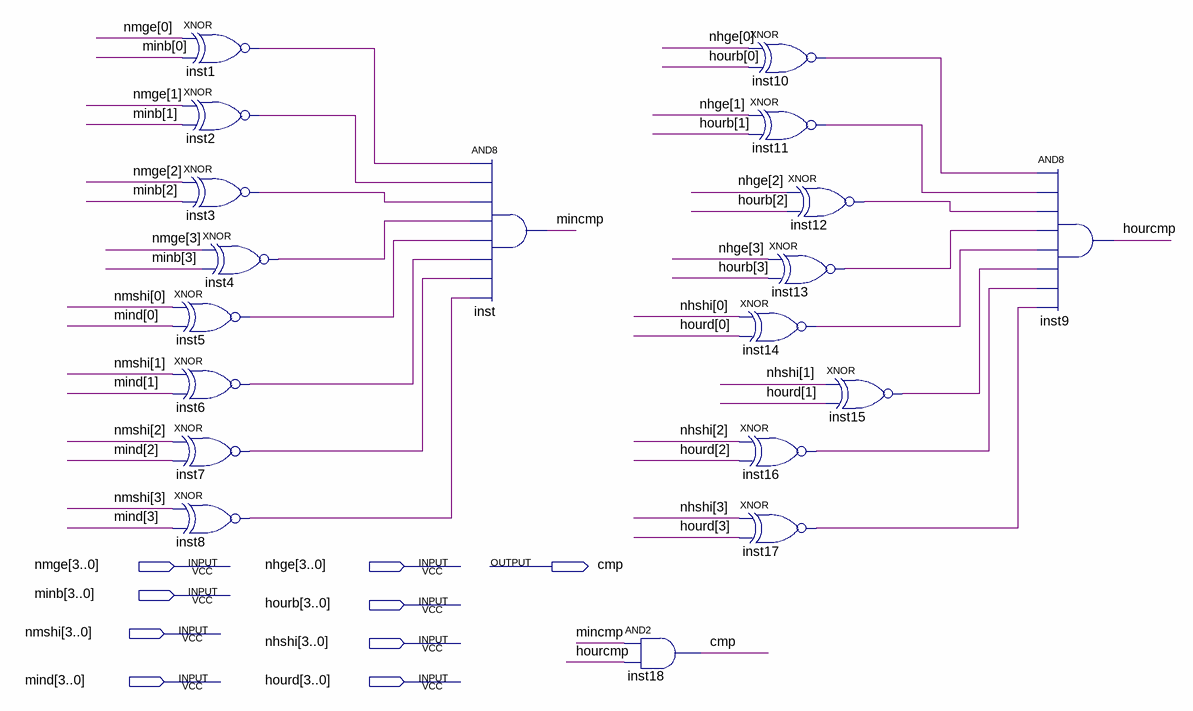
[diagram p0: schematic sheet]
// Quartus schematic compare.bdf as structural Verilog: 19 symbols, 9 pins
module compare (
  input  [3:0] nmge,
  input  [3:0] nhge,
  input  [3:0] minb,
  input  [3:0] hourb,
  input  [3:0] nmshi,
  input  [3:0] nhshi,
  input  [3:0] mind,
  input  [3:0] hourd,
  output cmp
);

  wire hourcmp, inst1_out, inst2_out, inst3_out, inst4_out, inst5_out, inst6_out, inst7_out, inst8_out,
       inst10_out, inst11_out, inst12_out, inst13_out, inst14_out, inst15_out, inst16_out, inst17_out, mincmp;

  xnor inst1 (inst1_out, nmge[0], minb[0]);
  xnor inst2 (inst2_out, nmge[1], minb[1]);
  xnor inst3 (inst3_out, nmge[2], minb[2]);
  xnor inst5 (inst5_out, nmshi[0], mind[0]);
  xnor inst6 (inst6_out, nmshi[1], mind[1]);
  xnor inst7 (inst7_out, nmshi[2], mind[2]);
  xnor inst8 (inst8_out, nmshi[3], mind[3]);
  xnor inst4 (inst4_out, nmge[3], minb[3]);
  and inst (mincmp, inst1_out, inst2_out, inst3_out, inst4_out, inst5_out, inst6_out, inst7_out, inst8_out);
  and inst18 (cmp, mincmp, hourcmp);
  xnor inst10 (inst10_out, nhge[0], hourb[0]);
  xnor inst11 (inst11_out, nhge[1], hourb[1]);
  xnor inst12 (inst12_out, nhge[2], hourb[2]);
  xnor inst13 (inst13_out, nhge[3], hourb[3]);
  xnor inst14 (inst14_out, nhshi[0], hourd[0]);
  xnor inst16 (inst16_out, nhshi[2], hourd[2]);
  xnor inst17 (inst17_out, nhshi[3], hourd[3]);
  xnor inst15 (inst15_out, nhshi[1], hourd[1]);
  and inst9 (hourcmp, inst10_out, inst11_out, inst12_out, inst13_out, inst14_out, inst15_out, inst16_out, inst17_out);
endmodule
